# Altium schematic sheet dc dc sepic 12-12.SchDoc
size A3; SheetNumber: 5; SheetTotal: 6
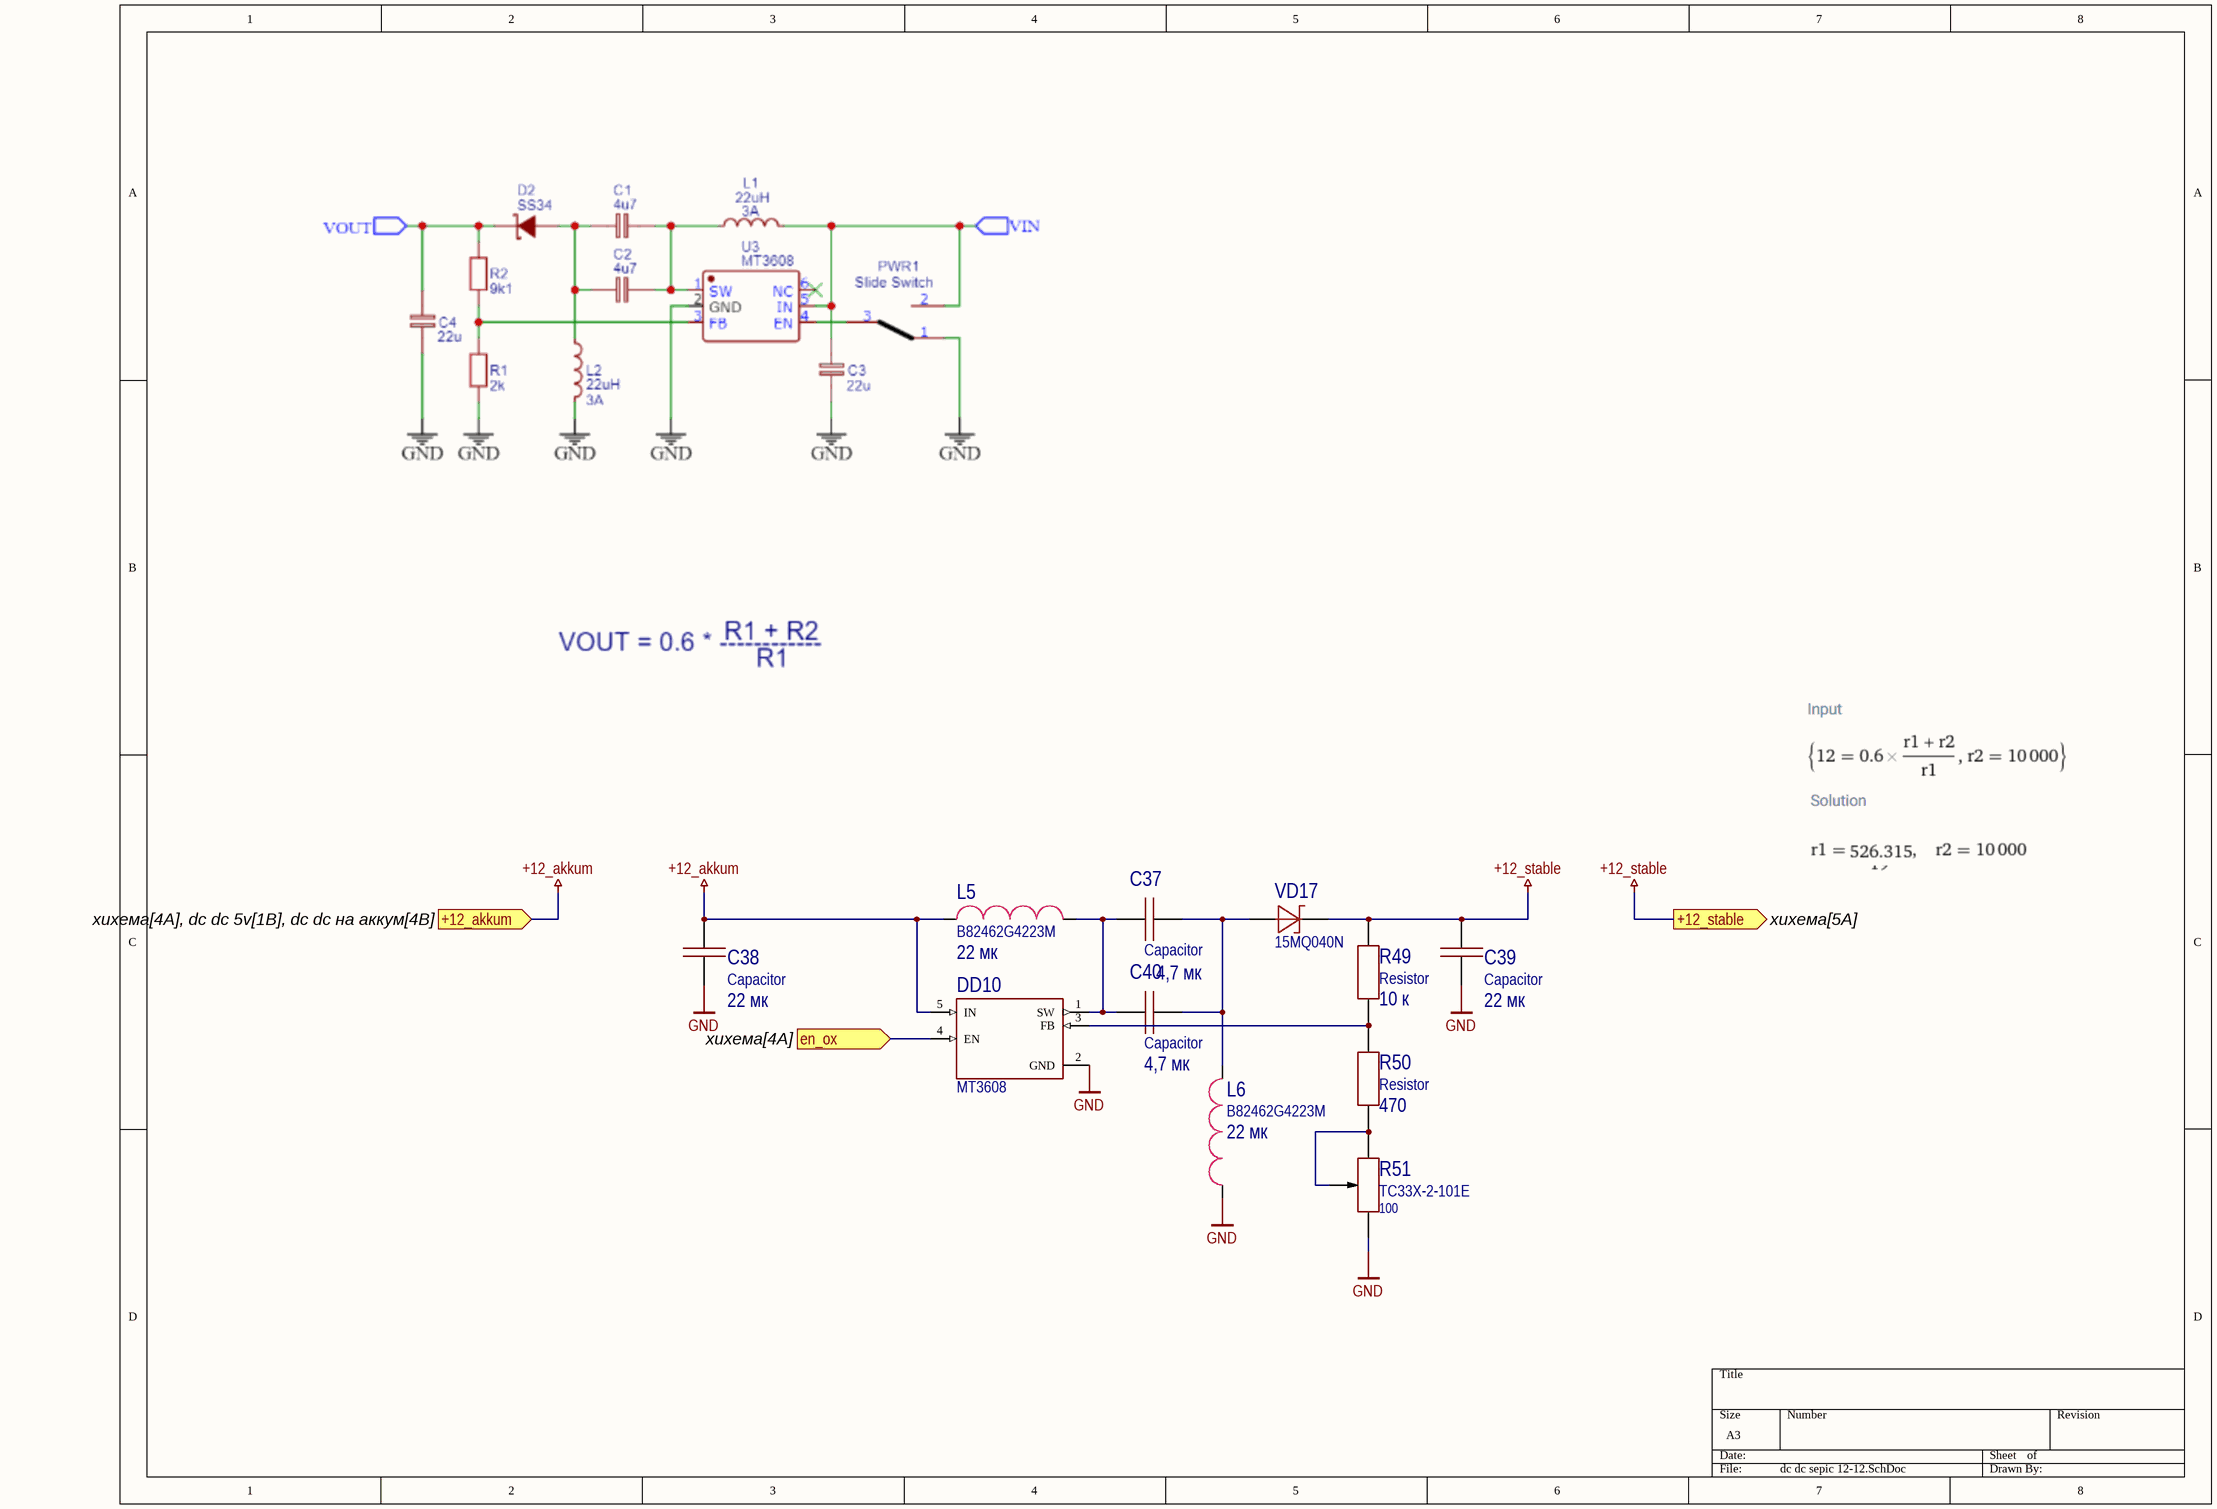
[diagram p0: dc dc sepic 12-12.SchDoc]

## Parts
C37  Capacitor  value 4,7 мк  [1206C]
C38  Capacitor  value 22 мк  [1210C]
C39  Capacitor  value 22 мк  [1210C]
C40  Capacitor  value 4,7 мк  [1206C]
DD10  MT3608  [SOT23-6]
L5  B82462G4223M  value 22 мк  [B82462G4]
L6  B82462G4223M  value 22 мк  [B82462G4]
R49  Resistor  value 10 к  [0603R]
R50  Resistor  value 470  [0603R]
R51  TC33X-2-101E  value 100  [3mm_trim]
VD17  15MQ040N  [SMA]

## Ports
+12_akkum (in, see хихема[4A], dc dc 5v[1B], dc dc на аккум[4B]), +12_stable (out, see хихема[5A]), en_ox (in, see хихема[4A])

## Nets
+12_akkum: C38.2 DD10.5(IN) L5.1 ; port +12_akkum
+12_stable: C39.2 R49.2 VD17.2 ; port +12_stable
GND: C38.1 C39.1 DD10.2(GND) L6.1 R51.1
en_ox: DD10.4(EN) ; port en_ox
NetC37_1: C37.1 C40.1 DD10.1(SW) L5.2
NetC37_2: C37.2 C40.2 L6.2 VD17.1
NetDD10_3: DD10.3(FB) R49.1 R50.2
NetR50_1: R50.1 R51.2 R51.3

## Library data of the parts
C37 C40 = Capacitor_4,7u_10_50V_X7R_1206C: Конденсатор; Tolerance: 0,1; Voltage (V): 50; Dielectric: X7R; Capacity (nF): 4700; Part Number: Capacitor_4,7u_10_50V_X7R_1206C
C38 C39 = Capacitor_22u_10_25V_X7R_1210C: Конденсатор; Tolerance: 0,1; Voltage (V): 25; Dielectric: X7R; Capacity (nF): 22000; Part Number: Capacitor_22u_10_25V_X7R_1210C
DD10 = MT3608: Повышающий/SEPIC DC-DC преобразователь 2А 1.2МГц; Part Number: MT3608
L5 L6 = B82462G4223M: ЧИП-индуктивность 22мкГн, 1.05A, ±20% катушка; Inductance (μH): 22; Current (A): 1.05; Part Number: B82462G4223M
R49 = Resistor_10k_1_0603: Резистор номиналом 10 кОм и точностью 1%; Power: *; Part Number: Resistor_10k_1_0603; Tolerance: 1%
R50 = Resistor_470_1_0603: Резистор номиналом 470 Ом и точностью 1%; Power: *; Part Number: Resistor_470_1_0603; Tolerance: 1%
R51 = TC33X-2-101E: Потенциометр керметный 100 Ом 0.1Вт для поверхностного монтажа; Tolerance: 50%; Part Number: TC33X-2-101E
VD17 = 15MQ040N: Диод шоттки на 40 В, ном. ток 2.1 А; Voltage nominal (V): 40; Current (A): 2.1; Part Number: 15MQ040N